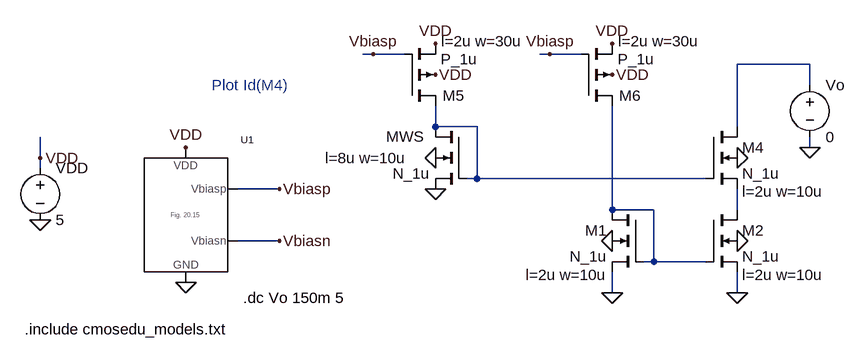
[diagram p0: schematic Fig20_33.asc]
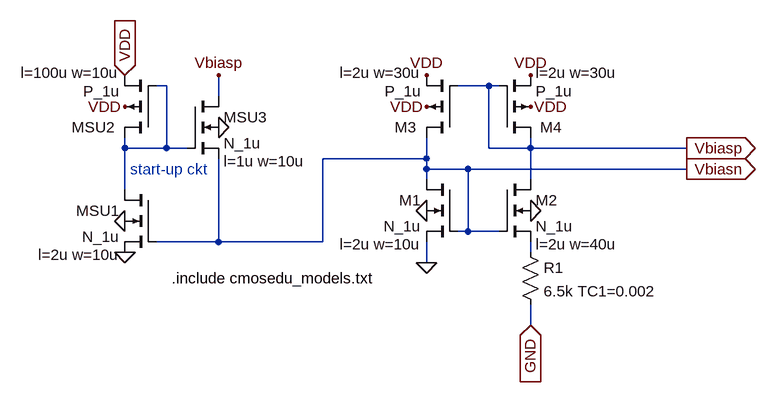
[diagram p1: sub-circuit fig_20_15.asc]
Fig20_33.asc, the LTspice schematic file:
Version 4
SHEET 1 1564 680
WIRE 800 -176 784 -176
WIRE 848 -176 800 -176
WIRE 1072 -176 1056 -176
WIRE 1120 -176 1072 -176
WIRE 1472 -160 1360 -160
WIRE 1472 -128 1472 -160
WIRE 896 -64 896 -96
WIRE 960 -64 896 -64
WIRE 1360 -64 1360 -160
WIRE 1472 -32 1472 -48
WIRE 288 -16 288 -48
WIRE 288 0 288 -16
WIRE 960 16 960 -64
WIRE 960 16 944 16
WIRE 1312 16 960 16
WIRE 656 32 592 32
WIRE 1168 64 1168 -96
WIRE 1232 64 1168 64
WIRE 1360 64 1360 32
WIRE 656 112 592 112
WIRE 1232 144 1232 64
WIRE 1232 144 1216 144
WIRE 1312 144 1232 144
WIRE 1168 192 1168 160
WIRE 1360 192 1360 160
FLAG 288 80 0
FLAG 288 -16 VDD
FLAG 512 -32 VDD
FLAG 512 176 0
FLAG 656 32 Vbiasp
FLAG 656 112 Vbiasn
FLAG 1168 112 0
FLAG 1168 192 0
FLAG 1472 -32 0
FLAG 896 -16 0
FLAG 1360 112 0
FLAG 1360 192 0
FLAG 1360 -16 0
FLAG 896 -144 VDD
FLAG 896 -192 VDD
FLAG 800 -176 Vbiasp
FLAG 896 32 0
FLAG 1168 -144 VDD
FLAG 1168 -192 VDD
FLAG 1072 -176 Vbiasp
SYMBOL voltage 288 -16 R0
WINDOW 123 0 0 Left 2
WINDOW 39 0 0 Left 2
SYMATTR InstName VDD
SYMATTR Value 5
SYMBOL nmos4 1216 64 M0
WINDOW 123 56 100 Left 2
SYMATTR Value2 l=2u w=10u
SYMATTR InstName M1
SYMATTR Value N_1u
SYMBOL voltage 1472 -144 R0
SYMATTR InstName Vo
SYMATTR Value 0
SYMBOL Fig_20_15 448 80 R0
SYMATTR InstName U1
SYMBOL nmos4 944 -64 M0
WINDOW 123 92 48 Left 2
WINDOW 0 65 15 Left 2
SYMATTR Value2 l=8u w=10u
SYMATTR InstName MWS
SYMATTR Value N_1u
SYMBOL nmos4 1312 64 R0
WINDOW 123 56 100 Left 2
SYMATTR Value2 l=2u w=10u
SYMATTR InstName M2
SYMATTR Value N_1u
SYMBOL nmos4 1312 -64 R0
WINDOW 123 56 100 Left 2
SYMATTR Value2 l=2u w=10u
SYMATTR InstName M4
SYMATTR Value N_1u
SYMBOL pmos4 848 -96 M180
WINDOW 0 59 16 Left 2
WINDOW 123 57 100 Left 2
SYMATTR InstName M5
SYMATTR Value2 l=2u w=30u
SYMATTR Value P_1u
SYMBOL pmos4 1120 -96 M180
WINDOW 0 59 16 Left 2
WINDOW 123 57 100 Left 2
SYMATTR InstName M6
SYMATTR Value2 l=2u w=30u
SYMATTR Value P_1u
TEXT 264 248 Left 2 !.include cmosedu_models.txt
TEXT 552 -128 Left 2 ;Plot Id(M4)
TEXT 600 200 Left 2 !.dc Vo 150m 5

fig_20_15.asc, the sub-circuit schematic file:
Version 4
SHEET 1 1556 680
WIRE 608 -80 592 -80
WIRE 1104 -80 1056 -80
WIRE 1120 -80 1104 -80
WIRE 688 -64 688 -96
WIRE 544 16 544 0
WIRE 608 16 608 -80
WIRE 608 16 544 16
WIRE 640 16 608 16
WIRE 1104 16 1104 -80
WIRE 1168 16 1168 0
WIRE 1168 16 1104 16
WIRE 1408 16 1168 16
WIRE 1008 32 1008 0
WIRE 1008 32 848 32
WIRE 1008 48 1008 32
WIRE 1072 48 1008 48
WIRE 1408 48 1072 48
WIRE 1008 64 1008 48
WIRE 1168 64 1168 16
WIRE 544 80 544 16
WIRE 1072 144 1072 48
WIRE 1072 144 1056 144
WIRE 1120 144 1072 144
WIRE 688 160 688 32
WIRE 688 160 592 160
WIRE 848 160 848 32
WIRE 848 160 688 160
WIRE 544 176 544 160
WIRE 1168 176 1168 160
WIRE 1008 192 1008 160
WIRE 1168 288 1168 256
FLAG 544 -48 VDD
FLAG 544 128 0
FLAG 688 -16 0
FLAG 688 -96 Vbiasp
FLAG 1008 -48 VDD
FLAG 1008 -96 VDD
FLAG 1168 -48 VDD
FLAG 1168 -96 VDD
FLAG 1008 192 0
FLAG 1008 112 0
FLAG 1168 112 0
FLAG 544 -96 VDD
IOPIN 544 -96 In
FLAG 544 176 0
FLAG 1408 16 Vbiasp
IOPIN 1408 16 Out
FLAG 1408 48 Vbiasn
IOPIN 1408 48 Out
FLAG 1168 288 GND
IOPIN 1168 288 In
SYMBOL pmos4 592 0 R180
WINDOW 0 63 16 Left 2
WINDOW 123 56 100 Left 2
SYMATTR InstName MSU2
SYMATTR Value2 l=100u w=10u
SYMATTR Value P_1u
SYMBOL nmos4 592 80 M0
WINDOW 123 56 100 Left 2
SYMATTR Value2 l=2u w=10u
SYMATTR InstName MSU1
SYMATTR Value N_1u
SYMBOL nmos4 640 -64 R0
WINDOW 123 56 100 Left 2
SYMATTR Value2 l=1u w=10u
SYMATTR InstName MSU3
SYMATTR Value N_1u
SYMBOL pmos4 1056 0 R180
WINDOW 0 63 16 Left 2
WINDOW 123 56 100 Left 2
SYMATTR InstName M3
SYMATTR Value2 l=2u w=30u
SYMATTR Value P_1u
SYMBOL pmos4 1120 0 M180
WINDOW 0 63 16 Left 2
WINDOW 123 56 100 Left 2
SYMATTR InstName M4
SYMATTR Value2 l=2u w=30u
SYMATTR Value P_1u
SYMBOL nmos4 1056 64 M0
WINDOW 123 56 100 Left 2
SYMATTR Value2 l=2u w=10u
SYMATTR InstName M1
SYMATTR Value N_1u
SYMBOL nmos4 1120 64 R0
WINDOW 123 56 100 Left 2
SYMATTR Value2 l=2u w=40u
SYMATTR InstName M2
SYMATTR Value N_1u
SYMBOL res 1152 160 R0
SYMATTR InstName R1
SYMATTR Value 6.5k TC1=0.002
TEXT 552 48 Left 2 ;start-up ckt
TEXT 616 216 Left 2 !.include cmosedu_models.txt

The netlist it stands for:
* Fig20_33.asc
VDD VDD 0 5
M1 N003 N003 0 0 N_1u l=2u w=10u
Vo N001 0 0
XU1 Vbiasn Vbiasp VDD 0 fig_20_15
MWS N002 N002 0 0 N_1u l=8u w=10u
M2 N004 N003 0 0 N_1u l=2u w=10u
M4 N001 N002 N004 0 N_1u l=2u w=10u
M5 N002 Vbiasp VDD VDD P_1u l=2u w=30u
M6 N003 Vbiasp VDD VDD P_1u l=2u w=30u

* block symbol definitions
.subckt fig_20_15 Vbiasn Vbiasp VDD GND
MSU2 N001 N001 VDD VDD P_1u l=100u w=10u
MSU1 N001 Vbiasn 0 0 N_1u l=2u w=10u
MSU3 Vbiasp N001 Vbiasn 0 N_1u l=1u w=10u
M3 Vbiasn Vbiasp VDD VDD P_1u l=2u w=30u
M4 Vbiasp Vbiasp VDD VDD P_1u l=2u w=30u
M1 Vbiasn Vbiasn 0 0 N_1u l=2u w=10u
M2 Vbiasp Vbiasn N002 0 N_1u l=2u w=40u
R1 N002 GND 6.5k TC1=0.002
* start-up ckt
.include cmosedu_models.txt
.ends fig_20_15

.model NMOS NMOS
.model PMOS PMOS
.lib standard.mos
.include cmosedu_models.txt
* Plot Id(M4)
.dc Vo 150m 5
.backanno
.end